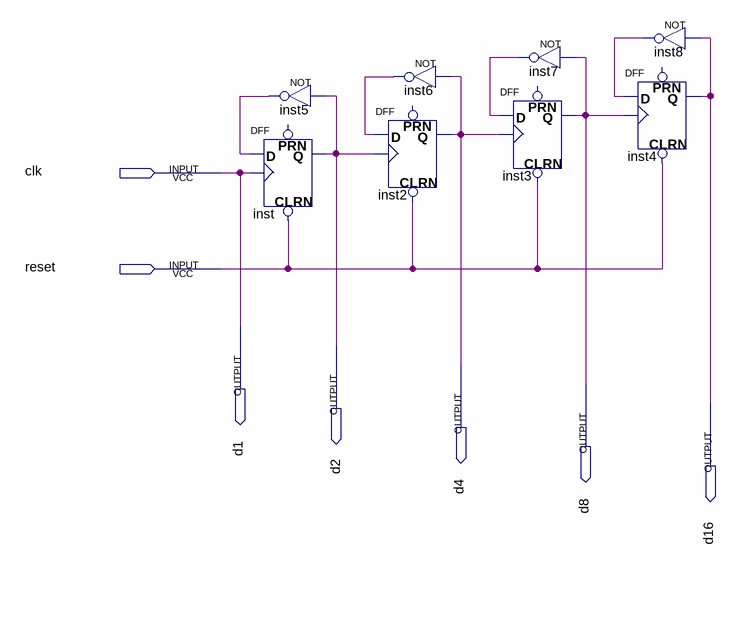
[diagram p0: schematic sheet]
// Quartus schematic rippleCounter.bdf as structural Verilog: 8 symbols, 7 pins
module rippleCounter (
  input  clk,
  input  reset,
  output d1,
  output d2,
  output d4,
  output d8,
  output d16
);

  wire inst5_out, inst6_out, inst7_out, inst8_out;

  not inst5 (inst5_out, d2);
  DFF inst (.CLRN(reset), .CLK(clk), .D(inst5_out), .Q(d2));  // open: PRN
  not inst6 (inst6_out, d4);
  DFF inst2 (.CLRN(reset), .CLK(d2), .D(inst6_out), .Q(d4));  // open: PRN
  DFF inst3 (.CLRN(reset), .CLK(d4), .D(inst7_out), .Q(d8));  // open: PRN
  not inst7 (inst7_out, d8);
  not inst8 (inst8_out, d16);
  DFF inst4 (.CLRN(reset), .CLK(d8), .D(inst8_out), .Q(d16));  // open: PRN

  assign d1 = clk;
endmodule
